# EAGLE design MultiProg (EAGLE 6.4)

## Sheet 1 of 2

## Sheet 2 of 2
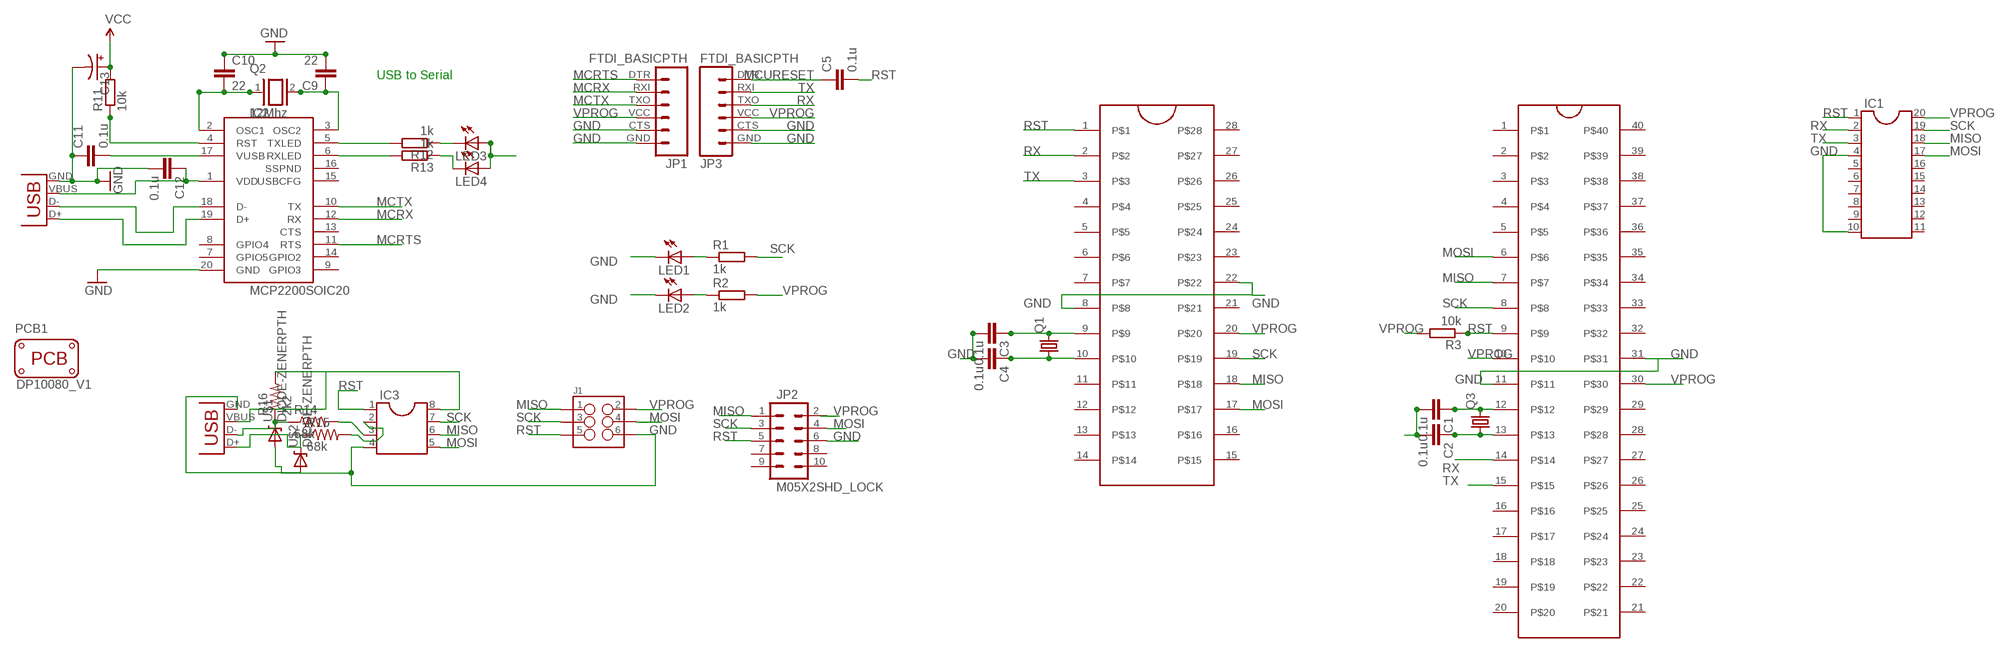
[diagram p0: schematic, sheet 2]

### Parts
C1  0.1u  CAPKIT  [CAP-PTH-SMALL-KIT]
C2  0.1u  CAPKIT  [CAP-PTH-SMALL-KIT]
C3  0.1u  CAPKIT  [CAP-PTH-SMALL-KIT]
C4  0.1u  CAPKIT  [CAP-PTH-SMALL-KIT]
C5  0.1u  CAPKIT  [CAP-PTH-SMALL-KIT]
C9  22  CAPKIT  [CAP-PTH-SMALL-KIT]
C10  22  CAPKIT  [CAP-PTH-SMALL-KIT]
C11  0.1u  CAPKIT  [CAP-PTH-SMALL-KIT]
C12  0.1u  CAPKIT  [CAP-PTH-SMALL-KIT]
C13  CAP_POLPTH1  [CPOL-RADIAL-100UF-25V]
IC1  DIL20  [DIL20]
IC2  MCP2200SOIC20  [SOIC20]
IC3  DIL8  [DIL08]
J1  M03X2SHROUD  [2X3-SHROUDED]
JP1  FTDI_BASICPTH  [FTDI_BASIC]
JP2  M05X2SHD_LOCK  [2X5-SHROUDED_LOCK]
JP3  FTDI_BASICPTH  [FTDI_BASIC]
LED1  LED3MM  [LED3MM]
LED2  LED3MM  [LED3MM]
LED3  LED3MM  [LED3MM]
LED4  LED3MM  [LED3MM]
PCB1  PCB_DP_RECTANGLE-80X100  [DP10080_V1]
Q1  CRYSTALHC49U70  [HC49U70]
Q2  12Mhz  XTAL/S  [QS]
Q3  CRYSTALHC49U70  [HC49U70]
R1  1k  R-EU_0204/7  [0204/7]
R2  1k  R-EU_0204/7  [0204/7]
R3  10k  R-EU_0204/7  [0204/7]
R11  10k  R-EU_0204/7  [0204/7]
R12  1k  R-EU_0204/7  [0204/7]
R13  1k  R-EU_0204/7  [0204/7]
R14  68k  R-US_0204/7  [0204/7]
R15  68k  R-US_0204/7  [0204/7]
R16  2k2  R-US_0204/7  [0204/7]
U$1  DIODE-ZENERPTH  [DIODE-ZENER]
U$2  DIODE-ZENERPTH  [DIODE-ZENER]
U$3  ZIFSOCKET-28-3ZIFFSOCKET-28-3  [DIL28-3-ZIF_SOCKET]
U$4  ZIFSOCKET-40-6DIL40-6-ZIF_SOCKET  [DIL40-6-ZIF_SOCKET]
X1  USBPTH  [USB-B-PTH]
X3  USBPTH  [USB-B-PTH]

### Nets
D+: R15.1 U$2.P$1(C) X3.D+
D-: R14.1 R16.1 U$1.P$1(C) X3.D-
GND: C1.2 C2.2 C3.2 C4.2 C9.2 C10.1 C11.1 C12.2 C13.2(-) IC1.4 IC1.10 IC2.20(GND) IC3.4 J1.6 JP1.CTS JP1.GND JP2.6 JP3.CTS JP3.GND LED1.K(C) LED2.K(C) U$1.P$2(A) U$2.P$2(A) U$3.8 U$3.22 U$4.11 U$4.31 X1.GND X3.GND
MCRTS: IC2.11(RTS) JP1.DTR
MCRX: IC2.12(RX) JP1.RXI
MCTX: IC2.10(TX) JP1.TXO
MCURESET: C5.1 JP3.DTR
MISO: IC1.18 IC3.6 J1.1 JP2.1 U$3.18 U$4.7
MOSI: IC1.17 IC3.5 J1.4 JP2.4 U$3.17 U$4.6
N$1: IC3.3 R14.2
N$2: C10.2 IC2.2(OSC1) Q2.1
N$3: C9.1 IC2.3(OSC2) Q2.2
N$4: IC2.18(D-) X1.D-
N$5: IC2.19(D+) X1.D+
N$6: C11.2 IC2.17(VUSB)
N$7: IC2.5(TXLED) R12.2
N$8: IC2.6(RXLED) R13.2
N$9: LED3.K(C) R12.1
N$10: LED4.K(C) R13.1
N$11: IC2.4(RST) R11.1
N$12: IC3.2 R15.2
N$14: LED2.A R2.1
N$15: LED1.A R1.1
N$24: C1.1 Q3.2 U$4.12
N$25: C2.1 Q3.1 U$4.13
N$26: C3.1 Q1.2 U$3.9
N$27: C4.1 Q1.1 U$3.10
RST: C5.2 IC1.1 IC3.1 J1.5 JP2.5 R3.1 U$3.1 U$4.9
RX: IC1.2 JP3.TXO U$3.2 U$4.14
SCK: IC1.19 IC3.7 J1.3 JP2.3 R1.2 U$3.19 U$4.8
TX: IC1.3 JP3.RXI U$3.3 U$4.15
VBUS: C12.1 IC2.1(VDD) LED3.A LED4.A X1.VBUS
VPROG: C13.1(+) IC1.20 IC3.8 J1.2 JP1.VCC JP3.VCC R2.2 R3.2 R11.2 R16.2 U$3.20 U$4.10 U$4.30 X3.VBUS ; supply symbol labelled VCC
Unconnected: IC1.5 IC1.6 IC1.7 IC1.8 IC1.9 IC1.11 IC1.12 IC1.13 IC1.14 IC1.15 IC1.16 IC2.7(GPIO5) IC2.8(GPIO4) IC2.9(GPIO3) IC2.13(CTS) IC2.14(GPIO2) IC2.15(USBCFG) IC2.16(SSPND) JP2.2 JP2.7 JP2.8 JP2.9 JP2.10 U$3.4 U$3.5 U$3.6 U$3.7 U$3.11 U$3.12 U$3.13 U$3.14 U$3.15 U$3.16 U$3.21 U$3.23 U$3.24 U$3.25 U$3.26 U$3.27 U$3.28 U$4.1 U$4.2 U$4.3 U$4.4 U$4.5 U$4.16 U$4.17 U$4.18 U$4.19 U$4.20 U$4.21 U$4.22 U$4.23 U$4.24 U$4.25 U$4.26 U$4.27 U$4.28 U$4.29 U$4.32 U$4.33 U$4.34 U$4.35 U$4.36 U$4.37 U$4.38 U$4.39 U$4.40

### Notes on the sheet
- USB to Serial

## Library data of the parts
C1-C5 C9-C12 = SparkFun-Passives:CAP: Capacitor Standard 0603 ceramic capacitor, and 0.1" leaded capacitor.
C13 = SparkFun-Passives:CAP_POL: Capacitor Polarized These are standard SMD and PTH capacitors. Normally 10uF, 47uF, and 100uF in electrolytic and tantalum varieties. Always verify the external diameter of the through hole cap, it varies with capacity, voltage, and manufacturer. The EIA devices should be standard.
IC1 = ic-package:DIL20: Dual In Line / Socket
IC2 = microchip-update-2:MCP2200: USB 2.0 to UART Protocol Converter with GPIO
IC3 = ic-package:DIL8: Dual In Line / Socket
J1 = SparkFun-Connectors:M03X2: 2x3 .1" header. Shrouded, with keying- CONN-10681 SMT- CONN-11415 Pogo pins- HW-11044; PROD_ID: CONN-10681
JP1 JP3 = SparkFun-Connectors:FTDI_BASIC: FTDI Basic header with labels
JP2 = SparkFun-Connectors:M05X2: Header 5x2 Standard 10-pin dual row 0.1" header. Commonly used with AVR-ISP. Use with Spark Fun Electronics SKU: PRT-00778
LED1-LED4 = led:LED: LED OSRAM: - CHIPLED LG R971, LG N971, LY N971, LG Q971, LY Q971, LO R971, LY R971 LH N974, LH R974 LS Q976, LO Q976, LY Q976 LO Q996 - Hyper CHIPLED LW Q18S LB Q993, LB Q99A, LB R99A - SideLED LS A670, LO A670, LY A670, LG A670, LP A670 LB A673, LV A673, LT A673, LW A673 LH A674 LY A675 LS A676, LA A676, LO A676, LY A676, LW A676 LS A679, LY A679, LG A679 - Hyper Micro SIDELED® LS Y876, LA Y876, LO Y876, LY Y876 LT Y87S - SmartLED LW L88C, LW L88S LB L89C, LB L89S, LG L890 LS L89K, LO L89K, LY L89K LS L896, LA L896, LO L896, LY L896 - TOPLED LS T670, LO T670, LY T670, LG T670, LP T670 LSG T670, LSP T670, LSY T670, LOP T670, LYG T670 LG T671, LOG T671, LSG T671 LB T673, LV T673, LT T673, LW T673 LH T674 LS T676, LA T676, LO T676, LY T676, LB T676, LH T676, LSB T676, LW T676 LB T67C, LV T67C, LT T67C, LS T67K, LO T67K, LY T67K, LW E67C LS E67B, LA E67B, LO E67B, LY E67B, LB E67C, LV E67C, LT E67C LW T67C LS T679, LY T679, LG T679 LS T770, LO T770, LY T770, LG T770, LP T770 LB T773, LV T773, LT T773, LW T773 LH T774 LS E675, LA E675, LY E675, LS T675 LS T776, LA T776, LO T776, LY T776, LB T776 LHGB T686 LT T68C, LB T68C - Hyper Mini TOPLED® LB M676 - Mini TOPLED Santana® LG M470 LS M47K, LO M47K, LY M47K Source: http://www.osram.convergy.de LUXEON: - LUMILED® LXK2-PW12-R00, LXK2-PW12-S00, LXK2-PW14-U00, LXK2-PW14-V00 LXK2-PM12-R00, LXK2-PM12-S00, LXK2-PM14-U00 LXK2-PE12-Q00, LXK2-PE12-R00, LXK2-PE12-S00, LXK2-PE14-T00, LXK2-PE14-U00 LXK2-PB12-K00, LXK2-PB12-L00, LXK2-PB12-M00, LXK2-PB14-N00, LXK2-PB14-P00, LXK2-PB14-Q00 LXK2-PR12-L00, LXK2-PR12-M00, LXK2-PR14-Q00, LXK2-PR14-R00 LXK2-PD12-Q00, LXK2-PD12-R00, LXK2-PD12-S00 LXK2-PH12-R00, LXK2-PH12-S00 LXK2-PL12-P00, LXK2-PL12-Q00, LXK2-PL12-R00 Source: www.luxeon.com KINGBRIGHT: KA-3528ASYC Source: www.kingbright.com
PCB1 = dp_devices:PCB_DP_RECTANGLE: Dangerous Prototypes Standard Rectangular PCB sizes; PCB_SIZE: DP10080_V1
Q1 Q3 = adafruit:CRYSTAL: CRYSTAL; OC_FARNELL: unknown; OC_NEWARK: unknown
Q2 = special:XTAL/S: CRYSTAL
R1-R3 R11-R13 = resistor:R-EU_: RESISTOR, European symbol
R14-R16 = adafruit:R-US_: RESISTOR, American symbol
U$1 U$2 = SparkFun-DiscreteSemi:DIODE-ZENER: Zener Diode Production Part - 8199 3.4V Zener Voltage
U$3 = SparkFun-Connectors:ZIFSOCKET-28-3: Lever-action ZIF socket for 28-pin ICs
U$4 = SparkFun-Connectors:ZIFSOCKET-40-6: Lever-action ZIF socket for 40-pin ICs
X1 X3 = SparkFun-Connectors:USB: USB Connectors USB-B-PTH is fully proven SKU : PRT-00139 USB-miniB is fully proven SKU : PRT-00587 USB-A-PCB is untested. USB-A-H is throughly reviewed, but untested. Spark Fun Electronics SKU : PRT-00437 USB-B-SMT is throughly reviewed, but untested. Needs silkscreen touching up. USB-A-S has not been used/tested USB-MB-H has not been used/tested

## Board
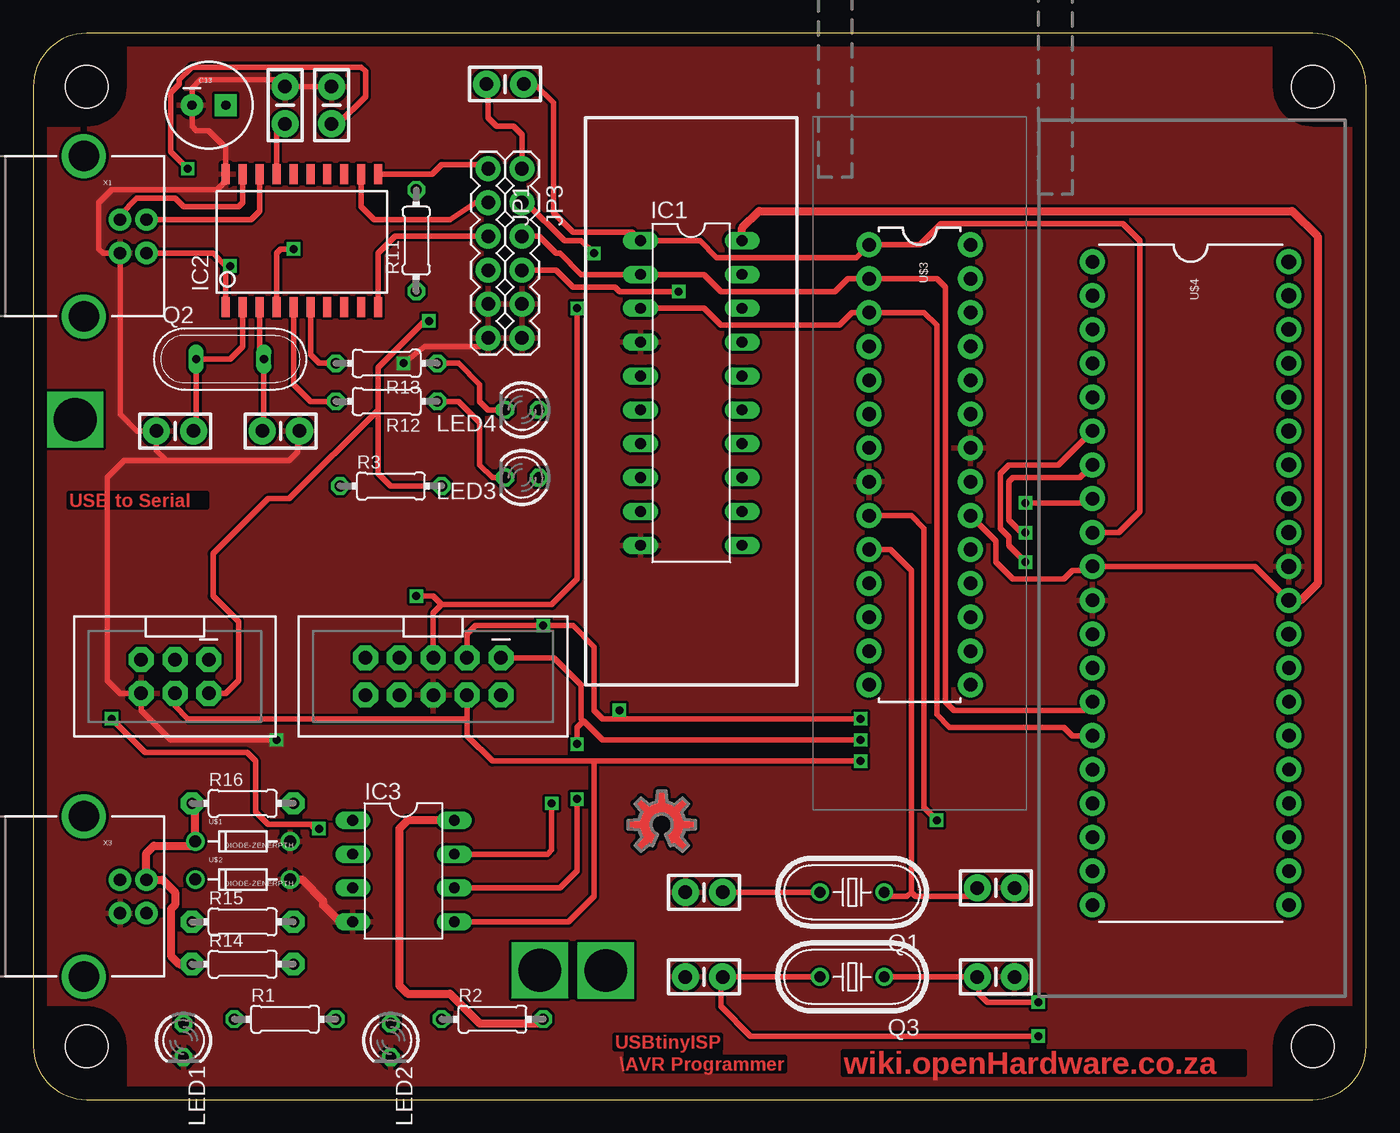
[diagram p1: board, top side]
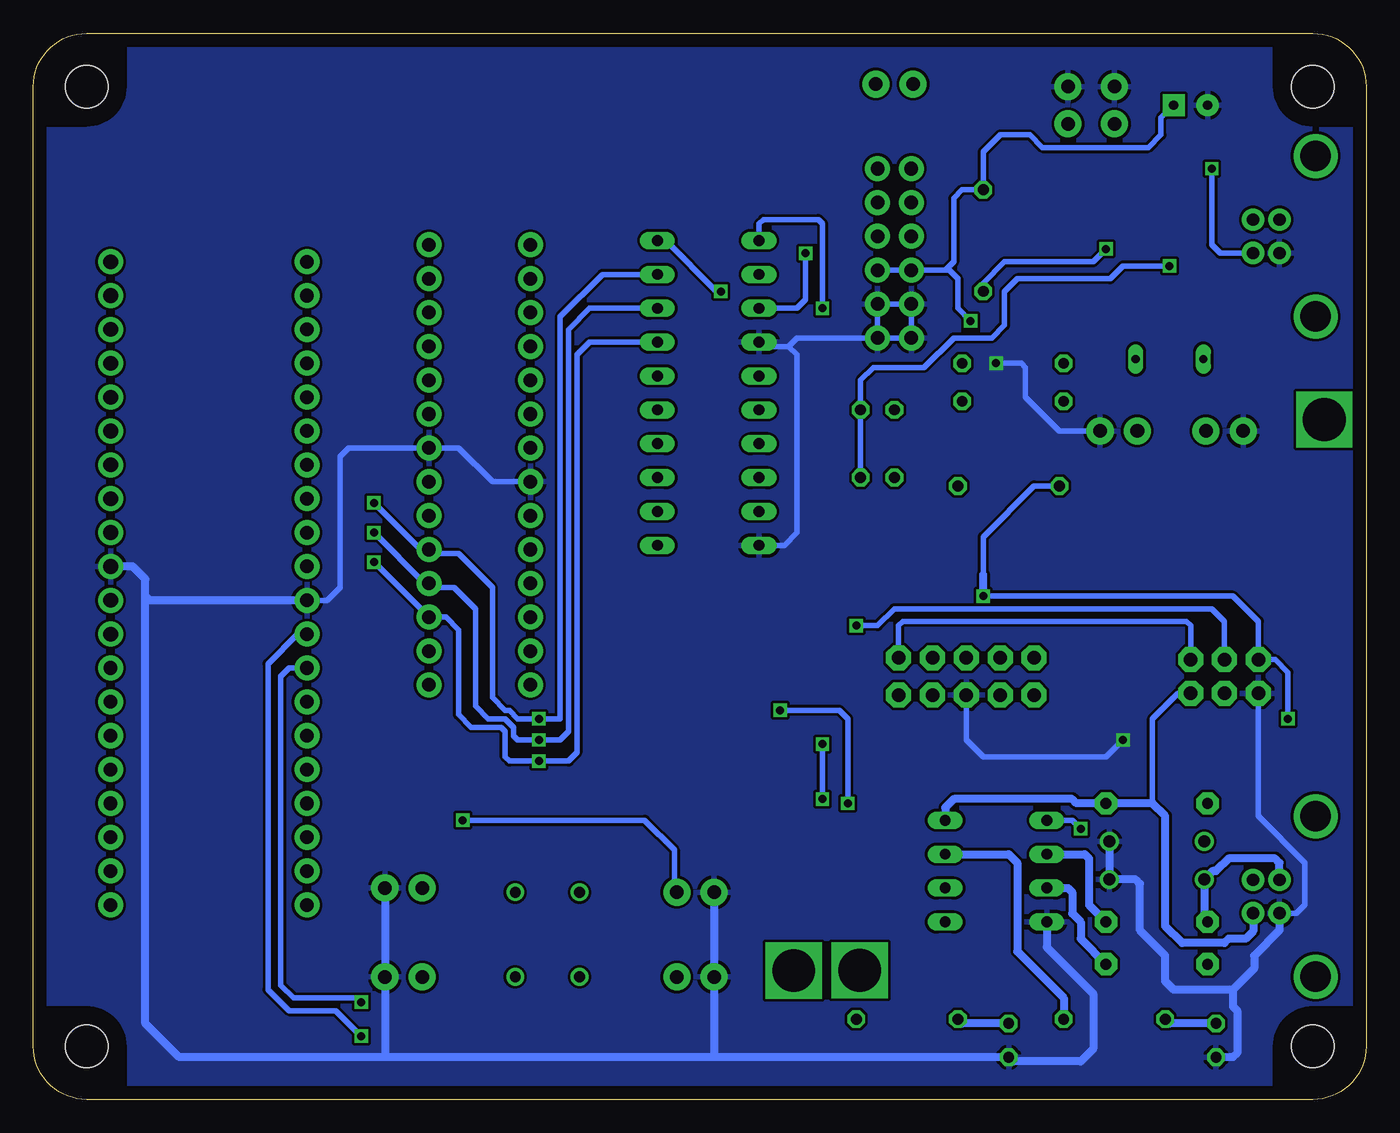
[diagram p2: board, bottom side, seen from below]

Size 100 x 80 mm. Coordinates in mm from the lower left corner, seen from the top.
Copper layers (1*16): Top 0.035mm / dielectric 1.5mm / Bottom 0.035mm
Design rules "default": minimum track width 10mil, minimum drill 24mil, track to track 8mil, track to pad 8mil, pad to pad 8mil, via to via 8mil, smd to smd 8mil, copper to edge 40mil, drill to drill 8mil, minimum pad ring 10mil, minimum via ring 8mil, stop-mask expansion 4mil, vias tented up to drill 0mil, thermal gap 10mil

### Footprints (pad centres in the part's own frame; a part is rotated, then mirrored left to right if it is on the bottom)
CAP-PTH-SMALL-KIT = drill 1.016 pad 2.032: 1 -1.397,0; 2 1.397,0
CPOL-RADIAL-100UF-25V = drill 0.7 pad 1.651 square: 1 1.27,0 | drill 0.7 pad 1.651: 2 -1.27,0
DIL20 = drill 0.813 long: 1 -11.43,-3.81; 2 -8.89,-3.81; 3 -6.35,-3.81; 4 -3.81,-3.81; 5 -1.27,-3.81; 6 1.27,-3.81; 7 3.81,-3.81; 8 6.35,-3.81; 9 8.89,-3.81; 10 11.43,-3.81; 11 11.43,3.81; 12 8.89,3.81; 13 6.35,3.81; 14 3.81,3.81; 15 1.27,3.81; 16 -1.27,3.81; 17 -3.81,3.81; 18 -6.35,3.81; 19 -8.89,3.81; 20 -11.43,3.81
SOIC20 = smd 0.6 x 1.5: 1 -5.715,-5; 2 -4.445,-5; 3 -3.175,-5; 4 -1.905,-5; 5 -0.635,-5; 6 0.635,-5; 7 1.905,-5; 8 3.175,-5; 9 4.445,-5; 10 5.715,-5; 11 5.715,5; 12 4.445,5; 13 3.175,5; 14 1.905,5; 15 0.635,5; 16 -0.635,5; 17 -1.905,5; 18 -3.175,5; 19 -4.445,5; 20 -5.715,5
DIL08 = drill 0.813 long: 1 -3.81,-3.81; 2 -1.27,-3.81; 3 1.27,-3.81; 4 3.81,-3.81; 5 3.81,3.81; 6 1.27,3.81; 7 -1.27,3.81; 8 -3.81,3.81
2X3-SHROUDED = drill 1.016 pad 1.88 octagon: 1 -1.27,2.54; 2 1.27,2.54; 3 -1.27,0; 4 1.27,0; 5 -1.27,-2.54; 6 1.27,-2.54
FTDI_BASIC = drill 1.016 pad 1.88: CTS 10.16,0; DTR 0,0; GND 12.7,0; RXI 2.54,0; TXO 5.08,0; VCC 7.62,0
2X5-SHROUDED_LOCK = drill 1.016 pad 1.88 octagon: 1 -1.397,5.08; 2 1.397,5.08; 3 -1.397,2.54; 4 1.397,2.54; 5 -1.397,0; 6 1.397,0; 7 -1.397,-2.54; 8 1.397,-2.54; 9 -1.397,-5.08; 10 1.397,-5.08
LED3MM = drill 0.813 octagon: A -1.27,0; K 1.27,0
DP10080_V1 = hole 3.2: -46,-36; 46,-36; 46,36; -46,36
HC49U70 = drill 0.813: 1 -2.413,0; 2 2.413,0
QS = drill 0.61 long: 1 -2.54,0; 2 2.54,0
0204/7 = drill 0.813 octagon: 1 -3.81,0; 2 3.81,0
0204/7' = drill 0.813 pad 1.676 octagon: 1 -3.81,0; 2 3.81,0
DIODE-ZENER = drill 0.9: P$1 -3.556,0; P$2 3.556,0
DIL28-3-ZIF_SOCKET = drill 1.016 pad 1.88: 1 -16.51,-3.81; 2 -13.97,-3.81; 3 -11.43,-3.81; 4 -8.89,-3.81; 5 -6.35,-3.81; 6 -3.81,-3.81; 7 -1.27,-3.81; 8 1.27,-3.81; 9 3.81,-3.81; 10 6.35,-3.81; 11 8.89,-3.81; 12 11.43,-3.81; 13 13.97,-3.81; 14 16.51,-3.81; 15 16.51,3.81; 16 13.97,3.81; 17 11.43,3.81; 18 8.89,3.81; 19 6.35,3.81; 20 3.81,3.81; 21 1.27,3.81; 22 -1.27,3.81; 23 -3.81,3.81; 24 -6.35,3.81; 25 -8.89,3.81; 26 -11.43,3.81; 27 -13.97,3.81; 28 -16.51,3.81
DIL40-6-ZIF_SOCKET = drill 1.016 pad 1.88: 1 -24.13,-7.366; 2 -21.59,-7.366; 3 -19.05,-7.366; 4 -16.51,-7.366; 5 -13.97,-7.366; 6 -11.43,-7.366; 7 -8.89,-7.366; 8 -6.35,-7.366; 9 -3.81,-7.366; 10 -1.27,-7.366; 11 1.27,-7.366; 12 3.81,-7.366; 13 6.35,-7.366; 14 8.89,-7.366; 15 11.43,-7.366; 16 13.97,-7.366; 17 16.51,-7.366; 18 19.05,-7.366; 19 21.59,-7.366; 20 24.13,-7.366; 21 24.13,7.366; 22 21.59,7.366; 23 19.05,7.366; 24 16.51,7.366; 25 13.97,7.366; 26 11.43,7.366; 27 8.89,7.366; 28 6.35,7.366 | drill 1.1 pad 1.88: 29 3.81,7.366; 30 1.27,7.366; 31 -1.27,7.366; 32 -3.81,7.366; 33 -6.35,7.366; 34 -8.89,7.366; 35 -11.43,7.366; 36 -13.97,7.366; 37 -16.51,7.366; 38 -19.05,7.366; 39 -21.59,7.366; 40 -24.13,7.366
USB-B-PTH = drill 0.914 pad 1.676: D+ 0,1.25; D- 1.981,1.25; GND 0,-1.25; VBUS 1.981,-1.25 | drill 2.286: S1 -2.718,-6.02; S2 -2.718,6.02

### Placement (x,y rotation side)
C1  50.32,9.2 180 top
C2  72.23,9.2 0 top
C3  50.32,15.55 180 top
C4  72.23,15.87 0 top
C5  35.4,76.2 0 top
C9  18.57,50.16 0 top
C10  10.63,50.16 0 top
C11  18.89,74.61 270 top
C12  22.38,74.61 90 top
C13  13.17,74.61 0 top
IC1  49.37,53.02 270 top
IC2  20.16,64.45 0 top
IC3  27.78,17.14 270 top
J1  10.63,31.75 270 top
JP1  34.13,69.84 270 top
JP2  30,31.75 270 top
JP3  36.67,69.84 270 top
LED1  11.27,4.44 270 top
LED2  26.82,4.44 270 top
LED3  36.67,46.67 180 top
LED4  36.67,51.75 180 top
PCB1  50,40 0 top
Q1  61.43,15.55 180 top
Q2  14.76,55.56 0 top
Q3  61.43,9.2 180 top
R1  18.89,6.03 0 top
R2  34.44,6.03 0 top
R3  26.82,46.03 0 top
R11  28.73,64.45 90 top
R12  26.51,52.38 180 top
R13  26.51,55.24 180 top
R14  68k  [0204/7']  15.71,10.16 0 top
R15  68k  [0204/7']  15.71,13.33 0 top
R16  2k2  [0204/7']  15.71,22.22 0 top
U$1  15.71,19.36 0 top
U$2  15.71,16.51 0 top
U$3  66.51,47.62 270 top
U$4  86.83,38.73 270 top
U$5  [OSHWLOGO_TOP_0.2]  47.14,20.63 0 top
X1  6.5,64.77 0 top
X3  6.5,15.24 0 top

### Tracks (layer width: path | path; a pad name or v marks a point on that pad's centre or on a via)
D+
  Bottom 0.61: X3.D+ 6.5,17.78 6.82,18.09 10.31,18.09 11.27,17.14 11.52,17.14 U$2.P$1 12.15,13.58 R15.1
D-
  Top 0.61: R16.1 12.15,21.97 U$1.P$1 11.84,19.05 9.04,19.05 8.48,18.49 X3.D- 9.7,16.48 10.63,15.55 10.63,14.6 10.31,14.28 10.31,10.79 10.95,10.16 R14.1
GND  (via drill 0.6)
  Top 0.406: C12.2 C11.1 18.38,76.51 12.54,76.51 11.9,75.88 C13.2 11.9,73.02 12.22,72.7 13.17,72.7 14.44,71.43 IC2.20 14.44,68.89 13.81,68.26 5.87,68.26 4.92,67.31 4.92,63.81 5.23,63.5 6.48,63.5 X1.GND 6.5,51.43 7.77,50.16 C10.1 9.23,48.7 10,47.94 | 10,47.94 19.2,47.94 19.84,48.57 19.84,50.03 C9.2 | v27.78,55.24 29.36,56.51 33.49,56.51 JP1.GND | 10,47.94 6.82,47.94 5.55,46.67 5.55,31.43 6.5,30.48 J1.6 8.09,29.21 10.31,26.98 v18.25,26.98
  Top 0.61: U$2.P$2 20.16,16.51 21.74,14.92 21.74,14.6 23.01,13.33 IC3.4
  Bottom 0.406: U$3.8 65.56,46.35 68.1,48.89 U$3.22 76.35,48.89 76.99,48.25 76.99,38.41 77.94,37.46 U$4.11 | JP3.GND JP3.CTS JP1.CTS JP1.GND 42.7,57.14 43.33,56.51 | IC1.4 45.24,56.51 43.33,56.51 | C9.2 23.01,50.16 25.55,52.7 25.55,54.92 25.87,55.24 v27.78,55.24 | J1.6 8.09,21.27 4.6,17.78 4.6,14.6 5.23,13.97 6.48,13.97 X3.GND | JP2.6 30,26.98 28.73,25.71 19.52,25.71 v18.25,26.98 | 43.33,56.51 42.7,55.88 42.7,42.54 43.65,41.59 IC1.10
  Bottom 0.61: X3.GND 6.5,12.7 8.41,10.79 8.41,9.84 10,8.25 | 10,8.25 14.44,8.25 15.08,8.89 15.08,10.79 16.98,12.7 16.98,16.19 17.3,16.51 U$2.P$2 U$1.P$2 | 10,8.25 10,6.98 9.68,6.66 9.68,3.49 10,3.17 LED1.K | IC3.4 23.97,11.43 20.47,7.93 20.47,3.81 21.43,2.85 26.51,2.85 LED2.K 48.73,3.17 | 48.73,3.17 73.81,3.17 | 73.81,3.17 89.05,3.17 91.59,5.71 91.59,37.78 | 91.59,37.78 91.59,39.05 92.55,40 U$4.31 | U$4.11 91.28,37.46 91.59,37.78 | C4.2 C2.2 73.62,3.36 73.81,3.17 | C3.2 C1.2 48.92,3.36 48.73,3.17
  pour Top: -1.75,80.96 101.12,80.96 101.12,-0.64 -1.75,-0.64
  pour Bottom: -1.12,-2.86 102.39,-2.86 102.39,81.59 -1.12,81.59
MCRTS
  Top 0.406: IC2.11 29.92,69.45 30.63,70.16 33.81,70.16 JP1.DTR
MCRX
  Top 0.406: IC2.12 24.6,66.99 25.55,66.03 31.27,66.03 33.17,67.31 JP1.RXI
MCTX
  Top 0.406: JP1.TXO 27.14,64.77 25.87,63.5 IC2.10
MCURESET
  Top 0.406: JP3.DTR 36.67,72.39 36.03,73.02 34.76,73.02 34.13,73.66 34.13,76.07 C5.1
MISO  (via drill 0.6)
  Top 0.406: v74.45,42.54 74.13,42.54 73.18,43.49 73.18,46.35 73.5,46.67 78.51,46.67 U$4.7 | v62.07,26.98 42.7,26.98 41.27,28.41 | JP2.1 39.08,33.14 41.11,31.11 41.11,28.57 41.27,28.41 | IC3.6 39.52,15.87 40.79,17.14 v40.79,22.54 | v40.79,26.66 40.79,27.94 41.27,28.41
  Bottom 0.406: IC1.18 58.26,59.37 59.84,57.78 59.84,27.62 60.48,26.98 v62.07,26.98 63.65,26.98 63.97,27.3 63.97,27.94 64.61,28.57 65.88,28.57 66.83,29.52 66.83,36.83 68.42,38.41 70,38.41 U$3.18 70.64,38.73 v74.45,42.54 | J1.1 13.17,35.55 13.49,35.87 34.76,35.87 35.08,35.55 JP2.1 | v40.79,22.54 v40.79,26.66
MOSI  (via drill 0.6)
  Top 0.406: v74.45,40.32 73.18,41.59 73.18,42.22 72.54,42.86 72.54,46.98 73.18,47.62 76.92,47.62 U$4.6 | v62.07,25.4 42.06,25.4 | 42.06,25.4 34.44,25.4 32.54,27.3 32.54,28.57 | JP2.4 32.54,28.57 | J1.4 10.63,29.52 11.58,28.57 32.54,28.57 | IC3.5 40.16,13.33 42.06,15.24 42.06,25.4
  Bottom 0.406: IC1.17 58.26,56.83 59.21,55.88 59.21,26.03 59.84,25.4 v62.07,25.4 64.29,25.4 64.61,25.71 64.61,27.62 64.92,27.94 67.15,27.94 68.1,28.89 68.1,35.24 69.05,36.19 U$3.17 v74.45,40.32
N$1
  Bottom 0.61: IC3.3 22.38,15.87 22.06,15.55 22.06,13.97 21.43,13.33 21.43,12.06 R14.2
N$2
  Top 0.406: IC2.2 15.71,56.51 14.76,55.56 Q2.1 12.22,50.35 C10.2
N$3
  Top 0.406: IC2.3 16.98,55.88 Q2.2 17.3,50.29 C9.1
N$4
  Top 0.406: X1.D- 16.33,66.02 16.98,66.67 IC2.18
N$5
  Top 0.406: X1.D+ 6.5,66.35 7.77,67.62 10.63,67.62 11.27,66.99 15.39,66.99 15.71,67.31 IC2.19
N$6
  Top 0.406: IC2.17 18.25,72.58 C11.2
N$7
  Top 0.406: IC2.5 19.52,53.65 20.79,52.38 R12.2
N$8
  Top 0.406: IC2.6 20.79,55.88 21.43,55.24 R13.2
N$9
  Top 0.406: R12.1 31.9,52.38 33.49,50.8 33.49,47.62 34.44,46.67 LED3.K
N$10
  Top 0.406: R13.1 31.9,55.24 33.49,53.65 33.49,52.38 34.13,51.75 LED4.K
N$11  (via drill 0.6)
  Top 0.406: v19.52,63.81 18.57,63.81 18.25,63.5 IC2.4
  Bottom 0.406: R11.1 28.73,61.27 27.14,62.86 20.47,62.86 v19.52,63.81
N$12
  Bottom 0.61: IC3.2 21.11,18.41 20.79,18.09 20.79,14.6 R15.2
N$13  (via drill 3.2)
  other vias: 42.95,9.68
N$14
  Bottom 0.61: LED2.A 30.32,5.71 R2.1
N$15
  Bottom 0.61: LED1.A 14.76,5.71 R1.1
N$16  (via drill 3.2)
  other vias: 38,9.69
N$17  (via drill 3.2)
  other vias: 3.14,51.02
N$24  (via drill 0.6)
  Top 0.406: v75.4,4.76 53.81,4.76 51.59,6.98 51.59,9.08 C1.1 Q3.2
  Bottom 0.406: U$4.12 80.16,34.92 82.39,32.7 82.39,8.25 80.8,6.66 77.31,6.66 v75.4,4.76
N$25  (via drill 0.6)
  Top 0.406: v75.4,7.3 71.59,7.3 70.96,7.93 70.96,9.08 C2.1 Q3.1
  Bottom 0.406: U$4.13 80.8,32.38 81.43,31.75 81.43,8.57 80.48,7.62 75.72,7.62 v75.4,7.3
N$26  (via drill 0.6)
  Top 0.406: Q1.2 C3.1 | U$3.9 65.88,43.81 66.83,42.86 66.83,21.9 v67.78,20.95
  Bottom 0.406: v67.78,20.95 54.13,20.95 51.91,18.73 51.91,15.74 C3.1
N$27
  Top 0.406: U$3.10 64.29,41.27 65.88,39.68 65.88,15.55 | 65.88,15.55 65.56,15.24 64.16,15.24 Q1.1 | 65.88,15.55 66.19,15.24 70.19,15.24 C4.1
RST  (via drill 0.6)
  Top 0.406: U$4.9 81.43,42.54 83.02,44.13 83.02,64.45 81.75,65.72 68.1,65.72 66.51,64.13 U$3.1 61.75,63.18 51.27,63.18 50,64.45 IC1.1 44.92,65.08 40.48,65.08 39.02,66.54 39.02,74.8 37.62,76.2 C5.2 | v40.79,59.37 40.79,39.05 38.89,37.14 30.63,37.14 | 30.63,37.14 30,36.51 JP2.5 | v28.73,37.78 30,37.78 30.63,37.14 | v21.43,20.32 21.11,20.32 20.79,20.63 17.62,20.63 16.66,21.59 16.66,25.4 16.03,26.03 8.41,26.03 v5.87,28.57
  Bottom 0.406: IC1.1 45.56,65.72 45.24,66.03 41.11,66.03 40.79,65.72 v40.79,59.37 | v28.73,37.78 10,37.78 8.09,35.87 J1.5 6.82,33.02 5.87,32.06 v5.87,28.57 | IC3.1 22.06,20.95 v21.43,20.32 | 28.73,39.37 28.73,42.22 24.92,46.03 R3.1
  Bottom 0.61: v28.73,37.78 28.73,39.37
RX
  Top 0.406: U$4.14 78.83,29.21 69.05,29.21 68.42,29.84 68.42,60.95 67.78,61.59 U$3.2 61.11,61.59 60.16,60.64 51.59,60.64 50.32,61.91 IC1.2 41.11,61.91 39.52,63.5 39.21,63.5 37.94,64.77 JP3.TXO
SCK  (via drill 0.6)
  Top 0.406: v74.45,44.76 79.15,44.76 U$4.8 | v62.07,28.57 44.29,28.57 | 44.29,28.57 42.7,28.57 42.06,29.21 42.06,33.97 40.48,35.55 v38.25,35.55 33.17,35.55 32.54,34.92 JP2.3 | IC3.7 38.57,18.41 38.89,18.73 v38.89,22.22 | v43.97,29.21 43.97,28.89 44.29,28.57
  Bottom 0.406: IC1.19 57.3,61.91 60.48,58.73 60.48,28.57 v62.07,28.57 63.65,28.57 64.29,29.21 64.61,29.21 65.56,30.16 65.56,38.41 68.1,40.95 70,40.95 U$3.19 70.96,41.27 v74.45,44.76 | J1.3 10.63,35.87 11.58,36.83 35.4,36.83 36.67,35.55 v38.25,35.55 | v38.89,22.22 38.89,28.57 39.52,29.21 v43.97,29.21
  Bottom 0.61: IC3.7 26.82,18.41 26.19,17.78 26.19,11.11 22.7,7.62 R1.2
TX  (via drill 0.6)
  Top 0.406: IC1.3 50.32,59.37 51.59,58.1 60.48,58.1 61.43,59.05 U$3.3 66.83,59.05 67.78,58.1 67.78,28.89 68.73,27.94 77.31,27.94 77.94,27.3 U$4.15 | JP3.RXI 36.98,67.31 39.84,64.45 41.11,64.45 v42.06,63.5
  Bottom 0.406: v42.06,63.5 42.06,60 42.7,59.37 IC1.3
VBUS  (via drill 0.6)
  Top 0.406: C12.1 22.89,73.21 24.92,75.24 24.92,77.15 24.6,77.47 11.9,77.47 10.95,76.51 10.95,76.2 10.31,75.56 10.31,71.11 v11.58,69.84 | X1.VBUS 8.5,63.5 13.49,63.5 14.44,62.54 IC2.1 14.44,62.22 v14.76,62.54
  Bottom 0.406: v11.58,69.84 11.58,64.13 10.95,63.5 8.5,63.5 X1.VBUS | v14.76,62.54 18.25,62.54 19.2,61.59 26.19,61.59 27.14,60.64 27.14,58.1 28.09,57.14 30.95,57.14 33.17,54.92 36.98,54.92 37.94,53.97 LED4.A LED3.A
VPROG  (via drill 0.6)
  Top 0.406: U$3.20 72.23,41.91 72.23,40.32 73.5,39.05 77.31,39.05 77.94,39.68 79.15,39.68 U$4.10 91.66,40 U$4.30 | v29.68,58.42 29.36,58.42 25.87,54.92 25.87,51.75 | 25.87,51.75 19.2,45.08 17.62,45.08 13.49,40.95 13.49,37.78 15.39,35.87 15.39,31.43 14.44,30.48 J1.2 | JP3.VCC 39.21,62.22 40.48,60.95 43.65,60.95 43.97,60.64 v48.41,60.64 | 25.87,51.75 25.87,46.98 26.82,46.03 R3.2
  Top 0.61: IC3.8 28.09,20.95 27.46,20.32 27.46,8.57 28.09,7.93 31.27,7.93 33.49,5.71 37.94,5.71 R2.2 | IC1.20 53.18,65.4 54.45,66.67 94.45,66.67 96.36,64.77 96.36,38.73 95.09,37.46 U$4.30
  Bottom 0.406: C13.1 15.39,73.66 15.39,72.39 16.35,71.43 24.28,71.43 25.24,72.39 27.46,72.39 28.73,71.11 R11.2 30.32,68.26 30.95,67.62 30.95,62.86 31.59,62.22 JP1.VCC | JP1.VCC JP3.VCC | JP1.VCC 31.27,62.22 30.63,61.59 30.63,59.37 v29.68,58.42 | v48.41,60.64 48.73,60.64 52.54,64.45 IC1.20 | 16.03,22.22 16.03,28.57 14.12,30.48 J1.2
  Bottom 0.61: X3.VBUS 8.48,12.62 9.04,12.06 10.31,12.06 10.63,11.74 13.81,11.74 15.08,13.01 15.08,21.27 16.03,22.22 R16.2 21.74,22.22 22.06,22.54 30.95,22.54 31.59,21.9 IC3.8

### Text on the board
Top: USB to Serial | USBtinyISP | \AVR Programmer | wiki.openHardware.co.za
OPENHWSILK: 0.1U | 0.1U | 0.1u | ATTINY | ATMEGA | ATMEGA | 13/25/45/85 | 8/48/88 | 164/324/644/1284 | Jumper to prog | 2313/4313 | 168/328 | *1284 Write Only | 100uF | Serial | ATmega | DTR | RST | RX | TX | MCP2200 | TX | RX | 10K | VCC | VCC | GND | GND | ATTINY13/25/45/85 | 1K | 12Mhz | 1K | RX | 16Mhz | 22p | 22p | 10K | TX | USB to Serial | MISO | SPI | RESET | SCK | OPENHW | Controllers | 20Mhz | ATTINY2313/4313 | GND | MOSI | VCC | ATMEGA8/48/88/168/328/328P | 2K2 | 3v6 | 16Mhz | 3v6 | 68R | ATtiny45/85 | USBTinyISp | Host | 22p | 22p | 68R | ATMEGA164/324/644/1284 | 220R | 220R | 22p | 20Mhz | 22p | USBtinyISP | \AVR Programmer | wiki.openHardware.co.za | PROGRAMMING | POWER